# EAGLE design roomba_mod (EAGLE 5.11)
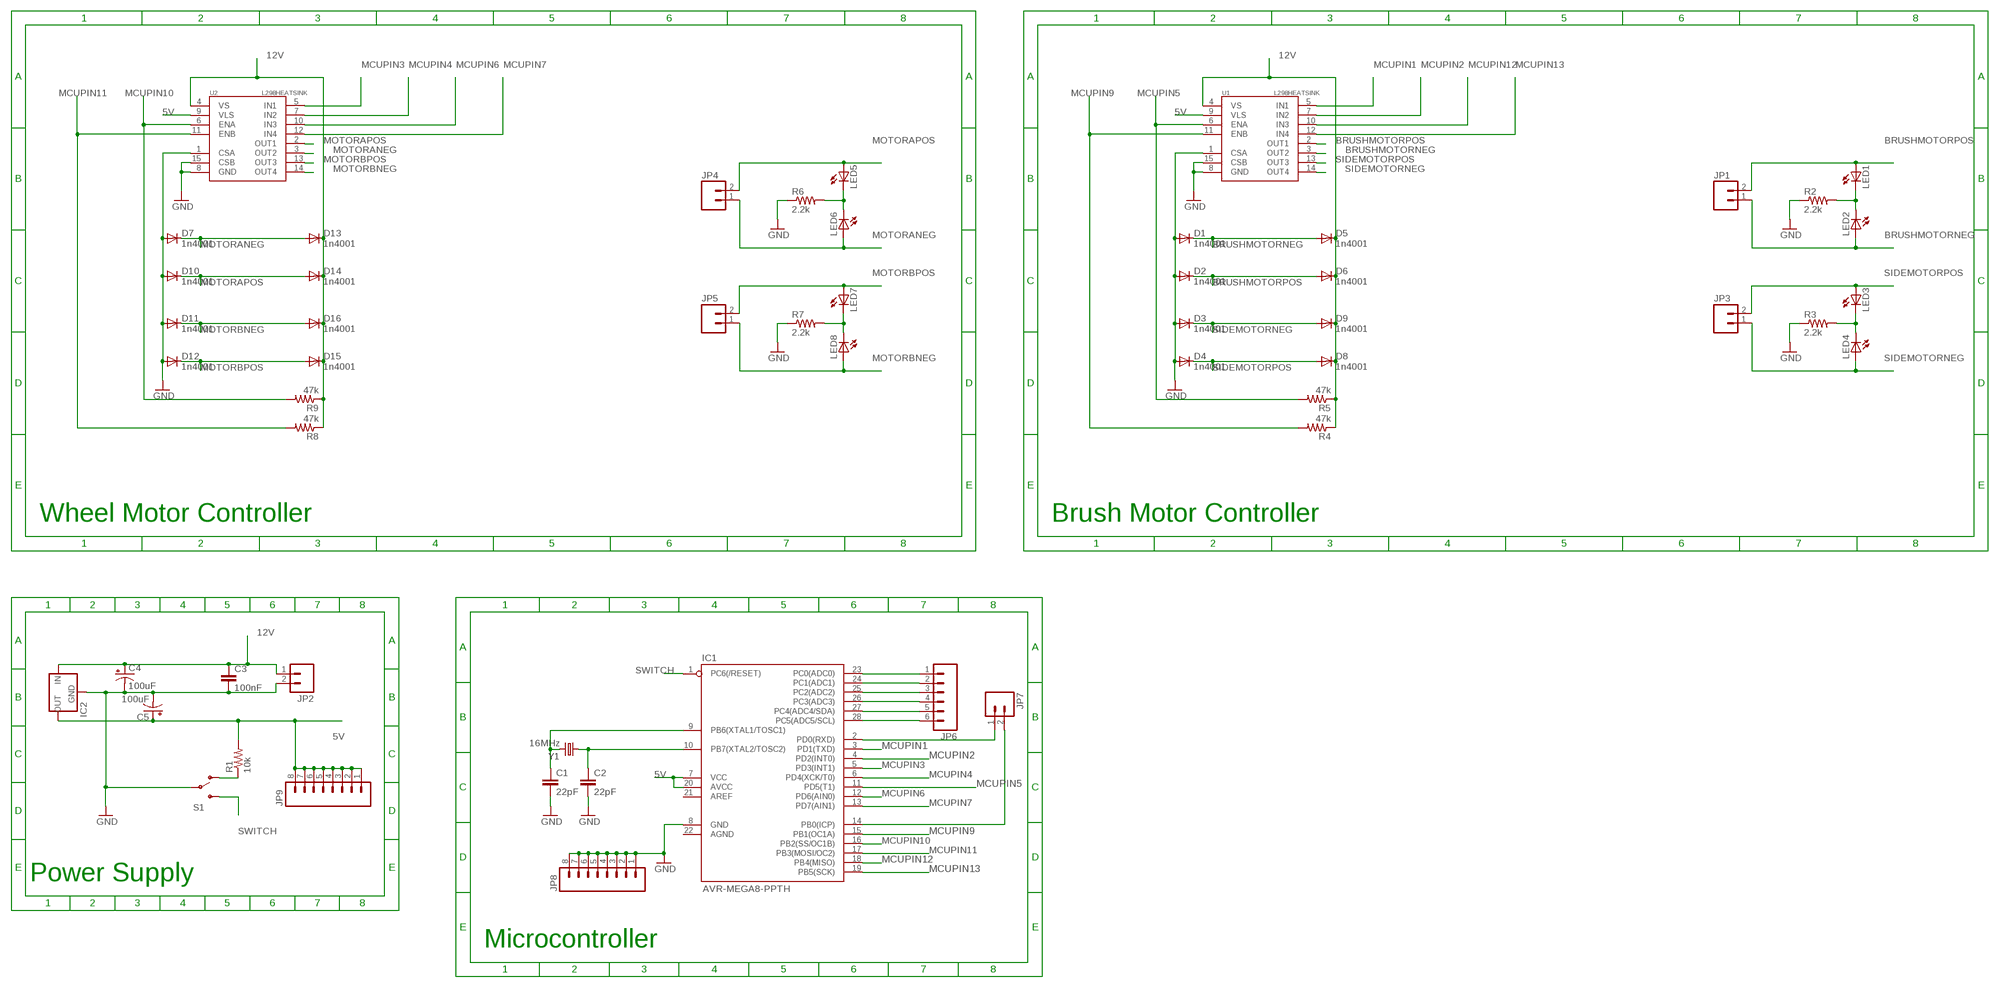
[diagram p0: schematic, sheet 1]

## Parts
C1  22pF  CAPPTH  [CAP-PTH-SMALL]
C2  22pF  CAPPTH  [CAP-PTH-SMALL]
C3  100nF  CAPKIT  [CAP-PTH-SMALL-KIT]
C4  100uF  CAP_POLPTH2  [CPOL-RADIAL-10UF-25V]
C5  100uF  CAP_POLPTH2  [CPOL-RADIAL-10UF-25V]
D1  1n4001  DIODEPTH  [DIODE-1N4001]
D2  1n4001  DIODEPTH  [DIODE-1N4001]
D3  1n4001  DIODEPTH  [DIODE-1N4001]
D4  1n4001  DIODEPTH  [DIODE-1N4001]
D5  1n4001  DIODEPTH  [DIODE-1N4001]
D6  1n4001  DIODEPTH  [DIODE-1N4001]
D7  1n4001  DIODEPTH  [DIODE-1N4001]
D8  1n4001  DIODEPTH  [DIODE-1N4001]
D9  1n4001  DIODEPTH  [DIODE-1N4001]
D10  1n4001  DIODEPTH  [DIODE-1N4001]
D11  1n4001  DIODEPTH  [DIODE-1N4001]
D12  1n4001  DIODEPTH  [DIODE-1N4001]
D13  1n4001  DIODEPTH  [DIODE-1N4001]
D14  1n4001  DIODEPTH  [DIODE-1N4001]
D15  1n4001  DIODEPTH  [DIODE-1N4001]
D16  1n4001  DIODEPTH  [DIODE-1N4001]
IC1  AVR-MEGA8-PPTH  [DIL28-3]
IC2  V_REG_78XXSIDE  [78XXL]
JP1  M025MM  [SCREWTERMINAL-5MM-2]
JP2  M025MM  [SCREWTERMINAL-5MM-2]
JP3  M025MM  [SCREWTERMINAL-5MM-2]
JP4  M025MM  [SCREWTERMINAL-5MM-2]
JP5  M025MM  [SCREWTERMINAL-5MM-2]
JP6  M06LOCK  [1X06_LOCK]
JP7  M02LOCK  [1X02_LOCK]
JP8  M08LOCK  [1X08_LOCK]
JP9  M08LOCK  [1X08_LOCK]
LED1  LED3MM  [LED3MM]
LED2  LED3MM  [LED3MM]
LED3  LED3MM  [LED3MM]
LED4  LED3MM  [LED3MM]
LED5  LED3MM  [LED3MM]
LED6  LED3MM  [LED3MM]
LED7  LED3MM  [LED3MM]
LED8  LED3MM  [LED3MM]
R1  10k  RESISTOR1206  [1206]
R2  2.2k  RESISTOR1206  [1206]
R3  2.2k  RESISTOR1206  [1206]
R4  47k  RESISTOR1206  [1206]
R5  47k  RESISTOR1206  [1206]
R6  2.2k  RESISTOR1206  [1206]
R7  2.2k  RESISTOR1206  [1206]
R8  47k  RESISTOR1206  [1206]
R9  47k  RESISTOR1206  [1206]
S1  SWITCH-SPSTPTH  [SWITCH-SPDT]
U1  L298HEATSINK  [MULTIWATT15_6400BGHEATSINK]
U2  L298HEATSINK  [MULTIWATT15_6400BGHEATSINK]
Y1  16MHz  CRYSTALSMD  [HC49UP]

## Nets
5V [mcuvcc]: C5.1(+) IC1.7(VCC) IC1.20(AVCC) IC2.OUT JP9.1 JP9.2 JP9.3 JP9.4 JP9.5 JP9.6 JP9.7 JP9.8 R1.2 U1.9(VLS) U2.9(VLS)
12V [power]: C3.1 C4.1(+) D5.C D6.C D8.C D9.C D13.C D14.C D15.C D16.C IC2.IN JP2.1 R4.1 R5.1 R8.1 R9.1 U1.4(VS) U2.4(VS)
BRUSHMOTORNEG [power]: D1.C D5.A JP1.1 LED2.A U1.3(OUT2)
BRUSHMOTORPOS [power]: D2.C D6.A JP1.2 LED1.A U1.2(OUT1)
GND [power]: C1.2 C2.2 C3.2 C4.2(-) C5.2(-) D1.A D2.A D3.A D4.A D7.A D10.A D11.A D12.A IC1.8(GND) IC2.GND JP2.2 JP8.1 JP8.2 JP8.3 JP8.4 JP8.5 JP8.6 JP8.7 JP8.8 R2.1 R3.1 R6.1 R7.1 S1.2(P) U1.1(CSA) U1.8(GND) U1.15(CSB) U2.1(CSA) U2.8(GND) U2.15(CSB)
MCUPIN1: IC1.3(PD1(TXD)) U1.5(IN1)
MCUPIN2: IC1.4(PD2(INT0)) U1.7(IN2)
MCUPIN3: IC1.5(PD3(INT1)) U2.5(IN1)
MCUPIN4: IC1.6(PD4(XCK/T0)) U2.7(IN2)
MCUPIN5: IC1.11(PD5(T1)) R5.2 U1.6(ENA)
MCUPIN6: IC1.12(PD6(AIN0)) U2.10(IN3)
MCUPIN7: IC1.13(PD7(AIN1)) U2.12(IN4)
MCUPIN9: IC1.15(PB1(OC1A)) R4.2 U1.11(ENB)
MCUPIN10: IC1.16(PB2(SS/OC1B)) R9.2 U2.6(ENA)
MCUPIN11: IC1.17(PB3(MOSI/OC2)) R8.2 U2.11(ENB)
MCUPIN12: IC1.18(PB4(MISO)) U1.10(IN3)
MCUPIN13: IC1.19(PB5(SCK)) U1.12(IN4)
MOTORANEG [power]: D7.C D13.A JP4.1 LED6.A U2.3(OUT2)
MOTORAPOS [power]: D10.C D14.A JP4.2 LED5.A U2.2(OUT1)
MOTORBNEG [power]: D11.C D16.A JP5.1 LED8.A U2.14(OUT4)
MOTORBPOS [power]: D12.C D15.A JP5.2 LED7.A U2.13(OUT3)
N$1: C1.1 IC1.9(PB6(XTAL1/TOSC1)) Y1.2
N$2: C2.1 IC1.10(PB7(XTAL2/TOSC2)) Y1.1
N$3: LED1.K(C) LED2.K(C) R2.2
N$4: LED5.K(C) LED6.K(C) R6.2
N$5: LED7.K(C) LED8.K(C) R7.2
N$6: R1.1 S1.1(O)
N$7: IC1.23(PC0(ADC0)) JP6.1
N$8: IC1.24(PC1(ADC1)) JP6.2
N$9: IC1.25(PC2(ADC2)) JP6.3
N$10: IC1.26(PC3(ADC3)) JP6.4
N$11: LED3.K(C) LED4.K(C) R3.2
N$12: IC1.27(PC4(ADC4/SDA)) JP6.5
N$13: IC1.28(PC5(ADC5/SCL)) JP6.6
N$14: IC1.2(PD0(RXD)) JP7.1
N$15: IC1.14(PB0(ICP)) JP7.2
SIDEMOTORNEG [power]: D3.C D9.A JP3.1 LED4.A U1.14(OUT4)
SIDEMOTORPOS [power]: D4.C D8.A JP3.2 LED3.A U1.13(OUT3)
SWITCH: IC1.1(PC6(/RESET)) S1.3(S)
Unconnected: IC1.21(AREF) IC1.22(AGND)

## Notes on the sheet
- Wheel Motor Controller | Brush Motor Controller
- Power Supply
- Microcontroller

## Library data of the parts
C1-C3 = SparkFun:CAP: Capacitor Standard 0603 ceramic capacitor, and 0.1" leaded capacitor.
C4 C5 = SparkFun:CAP_POL: Capacitor Polarized These are standard SMD and PTH capacitors. Normally 10uF, 47uF, and 100uF in electrolytic and tantalum varieties. Always verify the external diameter of the through hole cap, it varies with capacity, voltage, and manufacturer. The EIA devices should be standard.
D1-D16 = SparkFun:DIODE: Diode These are standard reverse protection diodes and small signal diodes. SMA package can handle up to about 1A. SOD-323 can handle about 200mA. What the SOD-323 package when ordering, there are some mfgs out there that are 5-pin packages.
IC1 = SparkFun:AVR-MEGA8-P: MICROCONTROLLER 8 Kbytes FLASH 1 kbytes SRAM 512 bytes EEPROM USART 4-channel 10 bit ADC 2-channel 8 bit ADC
IC2 = SparkFun:V_REG_78XX: Voltage Regulator Standard 7805 5V regulator. IGO (Input Ground Output). Spark Fun Electronics SKU : COM-00107
JP1-JP5 JP7 = SparkFun:M02: Header 2 Standard 2-pin 0.1" header. Use with straight break away headers (SKU : PRT-00116), right angle break away headers (PRT-00553), swiss pins (PRT-00743), machine pins (PRT-00117), and female headers (PRT-00115). Molex polarized connector foot print use with SKU : PRT-08233 with associated crimp pins and housings.
JP6 = SparkFun:M06: Header 6 Standard 6-pin 0.1" header. Use with straight break away headers (SKU : PRT-00116), right angle break away headers (PRT-00553), swiss pins (PRT-00743), machine pins (PRT-00117), and female headers (PRT-00115). Molex polarized connector foot print use with SKU : PRT-08094 with associated crimp pins and housings. NOTES ON THE VARIANTS LOCK and LOCK_LONGPADS... This footprint was designed to help hold the alignment of a through-hole component (i.e. 6-pin header) while soldering it into place. You may notice that each hole has been shifted either up or down by 0.005 of an inch from it's more standard position (which is a perfectly straight line). This slight alteration caused the pins (the squares in the middle) to touch the edges of the holes. Because they are alternating, it causes a "brace" to hold the component in place. 0.005 has proven to be the perfect amount of "off-center" position when using our standard breakaway headers. Although looks a little odd when you look at the bare footprint, once you have a header in there, the alteration is very hard to notice. Also, if you push a header all the way into place, it is covered up entirely on the bottom side. This idea of altering the position of holes to aid alignment will be further integrated into the Sparkfun Library for other footprints. It can help hold any component with 3 or more connection pins.
JP8 JP9 = SparkFun:M08: Header 8 Standard 8-pin 0.1" header. Use with straight break away headers (SKU : PRT-00116), right angle break away headers (PRT-00553), swiss pins (PRT-00743), machine pins (PRT-00117), and female headers (PRT-00115).
LED1-LED8 = SparkFun:LED: LEDs Standard schematic elements and footprints for 5mm, 3mm, 1206, and 0603 sized LEDs. 5mm - Spark Fun Electronics SKU : COM-00529 (and others)
R1-R9 = SparkFun:RESISTOR: Resistor Basic schematic elements and footprints for 0603, 1206, and PTH resistors.
S1 = SparkFun:SWITCH-SPST: SPST Switch Simple slide switch. Spark Fun Electronics SKU : COM-00102
U1 U2 = SparkFun:L298: L298 Dual Full Bridge Driver
Y1 = SparkFun:CRYSTAL: Crystals Various standard crystals. Proven footprints. Spark Fun Electronics SKU : COM-00534

## Net classes
1 power: width 0.889 mm, drill 0.508 mm, clearance 0.254 mm
2 mcuvcc: width 0.381 mm, drill 0.508 mm, clearance 0.203 mm

## Board
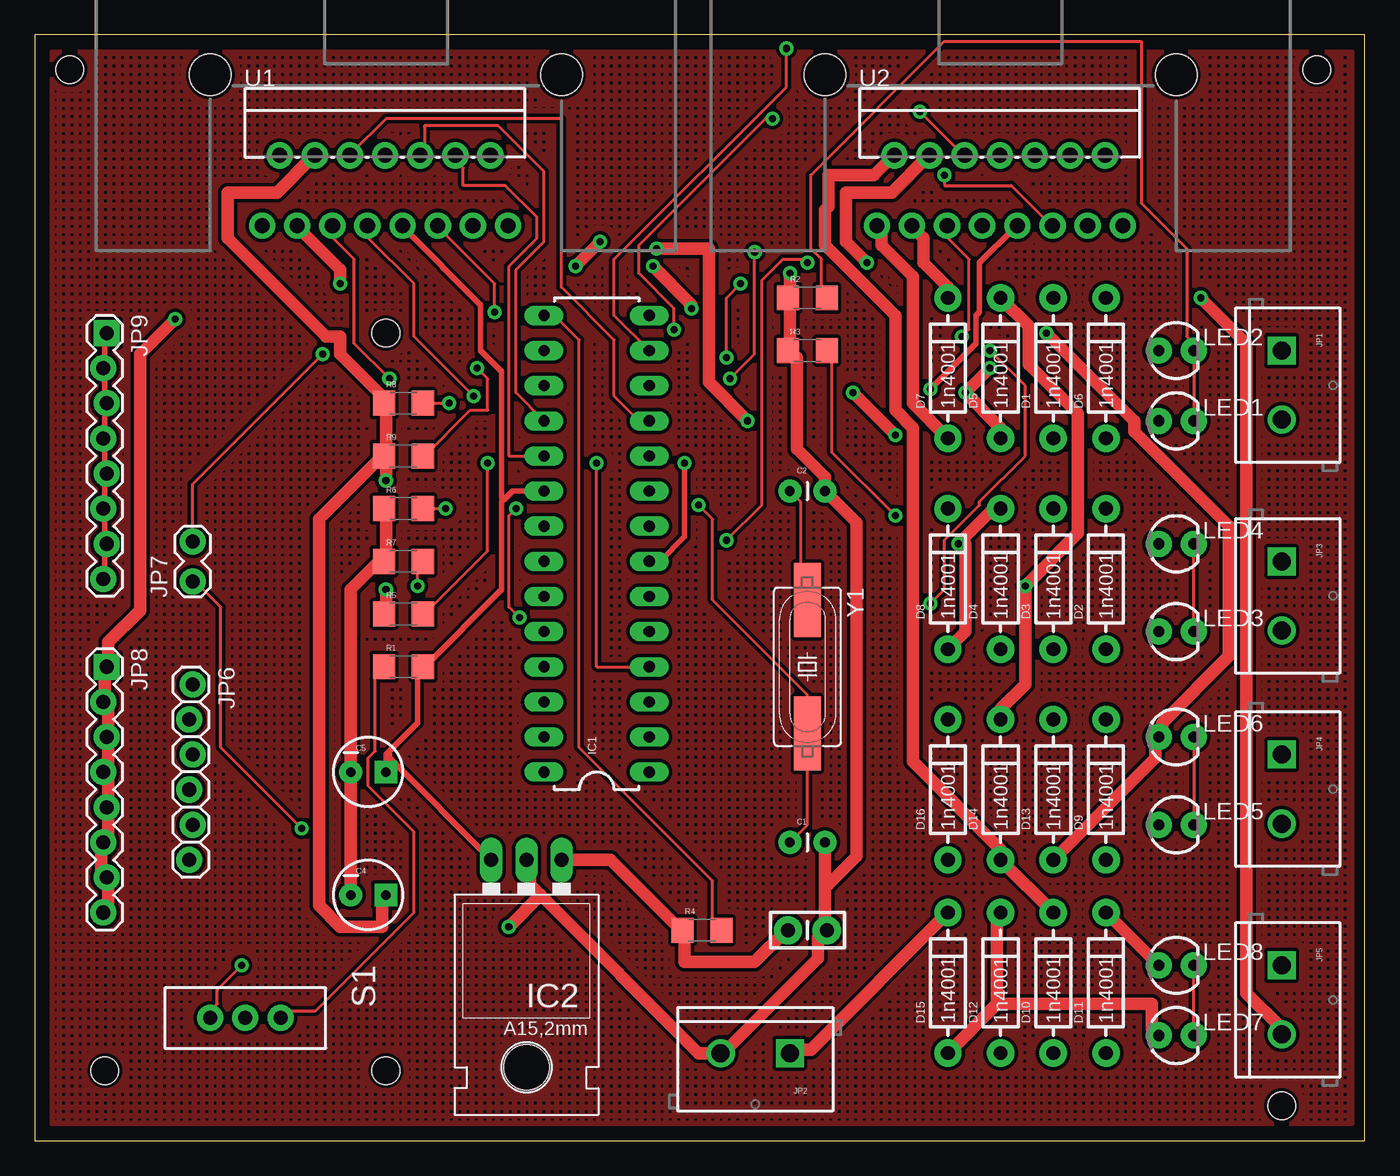
[diagram p1: board, top side]
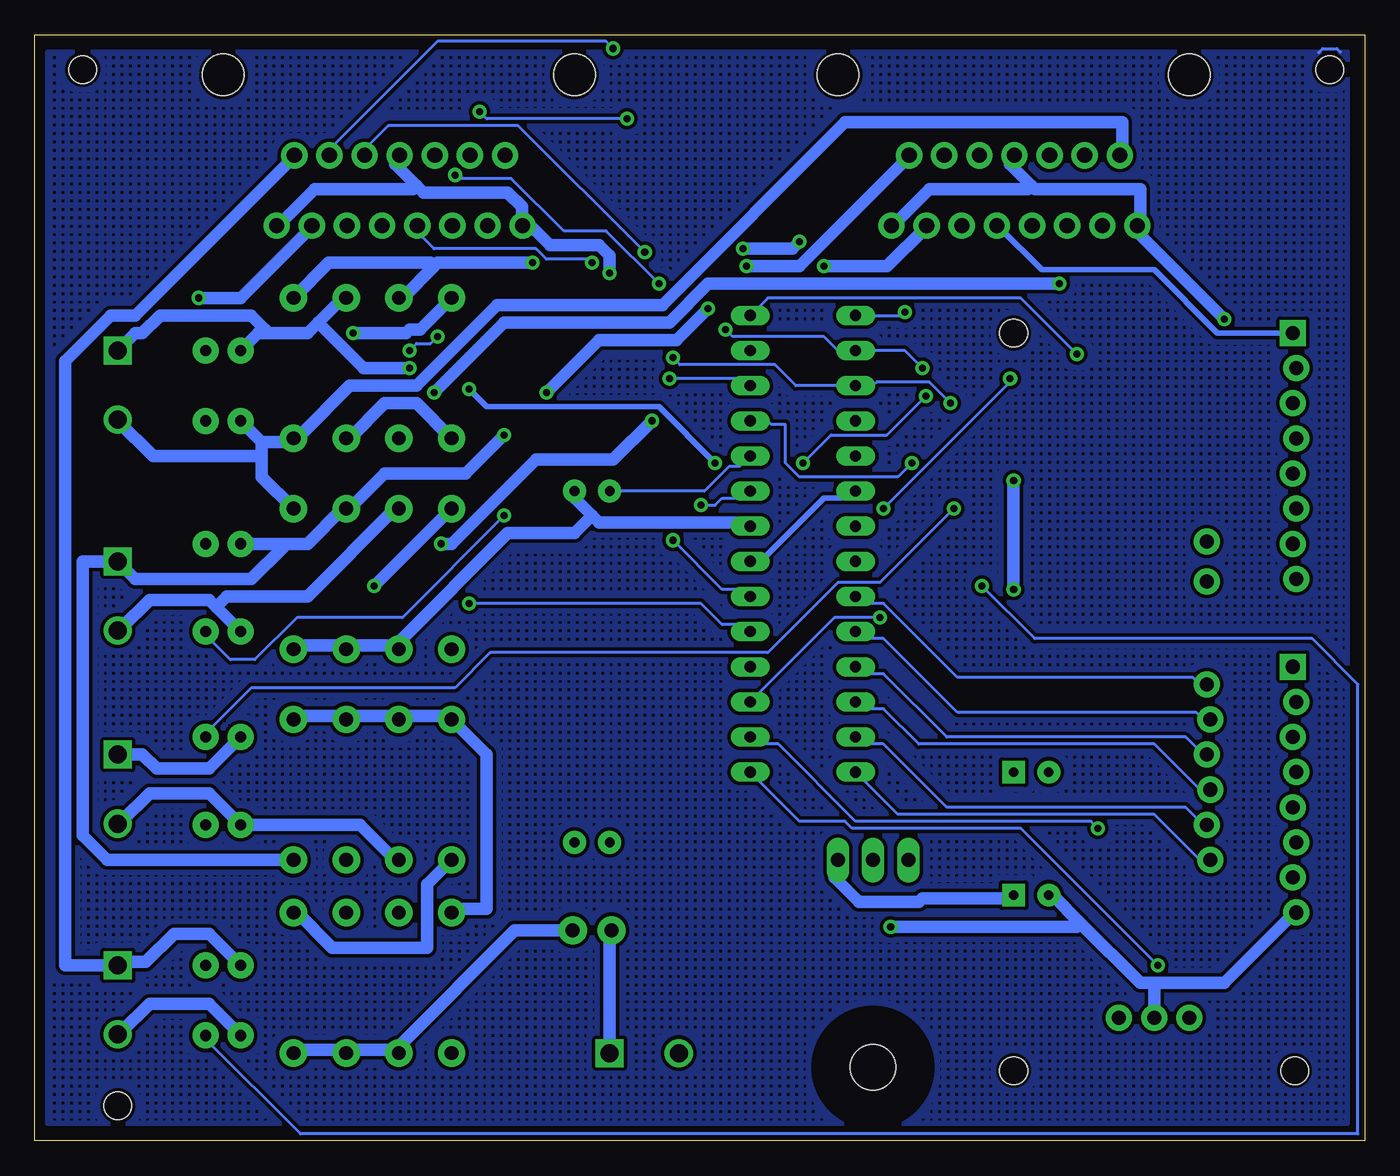
[diagram p2: board, bottom side, seen from below]

Size 96.19 x 80 mm. Coordinates in mm from the lower left corner, seen from the top.
Outline: 0,0 96.19,0 96.19,80 0,80 0,0
Copper layers (1*16): Top 0.035mm / dielectric 1.5mm / Bottom 0.035mm
Design rules "SparkFun": minimum track width 8mil, minimum drill 20mil, track to track 8mil, track to pad 8mil, pad to pad 8mil, via to via 8mil, smd to smd 8mil, copper to edge 10mil, drill to drill 8mil, minimum pad ring 12mil, minimum via ring 10mil, stop-mask expansion 4mil, vias tented up to drill 25mil, thermal gap 10mil
Holes 2 mm at 2.54,77.47 92.71,77.47 90.17,2.54 25.4,5.08 5.08,5.08 25.4,58.42

### Footprints (pad centres in the part's own frame; a part is rotated, then mirrored left to right if it is on the bottom)
CAP-PTH-SMALL = drill 0.7 pad 1.651 round: 1 0,0; 2 2.54,0
CAP-PTH-SMALL-KIT = drill 1.016 pad 2.032 round: 1 -1.397,0; 2 1.397,0
CPOL-RADIAL-10UF-25V = drill 0.7 pad 1.651 square: 1 1.27,0 | drill 0.7 pad 1.651 round: 2 -1.27,0
DIODE-1N4001 = drill 1 pad 1.981 round: A -5.08,0; C 5.08,0
DIL28-3 = drill 0.813 long: 1 -16.51,-3.81; 2 -13.97,-3.81; 3 -11.43,-3.81; 4 -8.89,-3.81; 5 -6.35,-3.81; 6 -3.81,-3.81; 7 -1.27,-3.81; 8 1.27,-3.81; 9 3.81,-3.81; 10 6.35,-3.81; 11 8.89,-3.81; 12 11.43,-3.81; 13 13.97,-3.81; 14 16.51,-3.81; 15 16.51,3.81; 16 13.97,3.81; 17 11.43,3.81; 18 8.89,3.81; 19 6.35,3.81; 20 3.81,3.81; 21 1.27,3.81; 22 -1.27,3.81; 23 -3.81,3.81; 24 -6.35,3.81; 25 -8.89,3.81; 26 -11.43,3.81; 27 -13.97,3.81; 28 -16.51,3.81
78XXL = drill 1.016 long: GND 0,-3.81; IN -2.54,-3.81; OUT 2.54,-3.81 | hole 3.302: 0,11.176
SCREWTERMINAL-5MM-2 = drill 1.3 pad 2.032 square: 1 0,0 | drill 1.3 pad 2.032 round: 2 5,0
1X06_LOCK = drill 1.016 pad 1.88 round: 1 0,0; 2 2.54,-0.254; 3 5.08,0; 4 7.62,-0.254; 5 10.16,0; 6 12.7,-0.254
1X02_LOCK = drill 1.016 pad 1.88 round: 1 -0.178,0; 2 2.718,0
1X08_LOCK = drill 1.016 pad 1.88 square: 1 0,0.127 | drill 1.016 pad 1.88 round: 2 2.54,-0.127; 3 5.08,0.127; 4 7.62,-0.127; 5 10.16,0.127; 6 12.7,-0.127; 7 15.24,0.127; 8 17.78,-0.127
LED3MM = drill 0.813 pad 1.88 round: A -1.27,0; K 1.27,0
1206 = smd 1.6 x 1.8: 1 -1.4,0; 2 1.4,0
SWITCH-SPDT = drill 1.016 pad 1.88 round: 1 0,2.54; 2 0,0; 3 0,-2.54
MULTIWATT15_6400BGHEATSINK = drill 1.1 pad 1.9 round: 1 -8.95,-2.39; 2 -7.68,2.69; 3 -6.41,-2.39; 4 -5.14,2.69; 5 -3.87,-2.39; 6 -2.6,2.69; 7 -1.33,-2.39; 8 -0.06,2.69; 9 1.21,-2.39; 10 2.48,2.69; 11 3.75,-2.39; 12 5.02,2.69; 13 6.29,-2.39; 14 7.56,2.69; 15 8.83,-2.39 | hole 2.997: -12.7,8.509; 12.7,8.509
HC49UP = smd 5.334 x 1.93: 1 -4.826,0; 2 4.826,0

### Placement (x,y rotation side)
C1  54.61,21.59 0 top
C2  54.61,46.99 0 top
C3  55.88,15.24 0 top
C4  24.13,17.78 0 top
C5  24.13,26.67 0 top
D1  73.66,55.88 90 top
D2  77.47,40.64 90 top
D3  73.66,40.64 90 top
D4  69.85,40.64 90 top
D5  69.85,55.88 90 top
D6  77.47,55.88 90 top
D7  66.04,55.88 90 top
D8  66.04,40.64 90 top
D9  77.47,25.4 90 top
D10  73.66,11.43 90 top
D11  77.47,11.43 90 top
D12  69.85,11.43 90 top
D13  73.66,25.4 90 top
D14  69.85,25.4 90 top
D15  66.04,11.43 90 top
D16  66.04,25.4 90 top
IC1  40.64,43.18 90 top
IC2  35.56,16.51 180 top
JP1  90.17,57.15 270 top
JP2  54.61,6.35 180 top
JP3  90.17,41.91 270 top
JP4  90.17,27.94 270 top
JP5  90.17,12.7 270 top
JP6  11.43,33.02 270 top
JP7  11.43,40.64 90 top
JP8  5.08,34.29 270 top
JP9  5.08,58.42 270 top
LED1  82.55,52.07 0 top
LED2  82.55,57.15 0 top
LED3  82.55,36.83 0 top
LED4  82.55,43.18 0 top
LED5  82.55,22.86 0 top
LED6  82.55,29.21 0 top
LED7  82.55,7.62 0 top
LED8  82.55,12.7 0 top
R1  26.67,34.29 0 top
R2  55.88,60.96 0 top
R3  55.88,57.15 0 top
R4  48.26,15.24 0 top
R5  26.67,38.1 0 top
R6  26.67,45.72 0 top
R7  26.67,41.91 0 top
R8  26.67,53.34 0 top
R9  26.67,49.53 0 top
S1  15.24,8.89 270 top
U1  25.4,68.58 0 top
U2  69.85,68.58 0 top
Y1  55.88,34.29 270 top

### Tracks (layer width: path | path; a pad name or v marks a point on that pad's centre or on a via)
5V  (via drill 0.51)
  Top 0.381: 5.08,50.8 5.08,53.34 | 5.08,43.18 5.08,40.64 JP9.8 | 5.08,45.72 5.08,48.26 | 5.08,43.18 5.08,45.72 | 5.08,43.18 JP9.7 | 5.08,45.72 JP9.6 | 5.08,48.26 5.08,50.8 | 5.08,50.8 JP9.4 | 5.08,48.26 JP9.5 | 5.08,55.88 5.08,58.42 JP9.1 | 5.08,53.34 5.08,55.88 | 5.08,53.34 JP9.3 | 5.08,55.88 JP9.2 | 25.53,28.07 25.4,27.94 C5.1 | 25.53,28.07 27.69,30.23 27.69,34.04 27.94,34.29 R1.2 28.19,34.29 33.78,39.88 33.78,46.23 33.91,46.35 | IC2.OUT 25.65,27.69 25.65,27.94 25.53,28.07 | v64.77,54.36 68.07,57.66 68.07,59.69 68.33,59.94 68.33,63.5 70.87,66.04 U2.9 | v46.99,49.02 46.99,43.69 45.21,41.91 IC1.7 | 33.91,46.35 34.54,46.99 IC1.20 | U1.9 26.67,66.04 32.26,60.45 32.26,57.15 33.78,55.63 33.78,46.48 33.91,46.35
  Bottom 0.381: U1.9 26.42,66.04 23.37,62.99 15.24,62.99 10.67,58.42 JP9.1 | IC1.20 37.34,46.48 39.12,46.48 43.69,41.91 IC1.7 | v64.77,54.36 63.5,53.09 51.05,53.09 v46.99,49.02
12V  (via drill 0.51)
  Top 0.889: v60.2,63.5 58.67,65.02 58.67,68.58 61.98,68.58 64.52,71.12 U2.4 | D14.C 69.85,31.24 71.63,33.02 v71.63,40.13 75.44,43.94 75.44,52.58 71.88,56.13 71.88,58.93 D5.C | v25.4,39.88 25.4,38.1 R5.1 | v25.4,47.75 25.4,49.53 R9.1 | R9.1 25.4,49.78 25.4,53.34 R8.1 25.15,53.59 25.15,53.85 22.1,56.9 22.1,58.17 21.08,58.17 13.97,65.28 13.97,68.58 17.53,68.58 20.07,71.12 U1.4 | D15.C 56.13,6.6 54.61,6.6 JP2.1 | IC2.IN 41.66,20.32 46.74,15.24 R4.1 46.99,14.99 46.99,12.95 52.07,12.95 54.36,15.24 C3.1 | C4.1 25.15,17.53 25.15,15.49 22.1,15.49 20.57,17.02 20.57,44.96 24.89,49.28 R9.1
  Bottom 0.889: v60.2,63.5 67.06,63.5 67.31,63.25 | 67.31,63.25 69.6,60.96 D5.C | D6.C 74.93,63.5 67.56,63.5 67.31,63.25 | D9.C 77.22,30.73 73.91,30.73 D13.C 73.41,30.73 70.1,30.73 D14.C 69.34,30.48 69.09,30.73 66.29,30.73 D16.C 63.5,27.94 63.5,16.76 65.28,16.76 65.53,16.51 D15.C | v71.63,40.13 D8.C | v25.4,47.75 v25.4,39.88 | JP2.1 54.61,15.24 C3.1 | C4.1 25.65,17.53 32,17.53 32.26,17.27 36.58,17.27 38.35,19.05 38.35,20.32 IC2.IN
BRUSHMOTORNEG  (via drill 0.51)
  Top 0.889: v22.1,61.98 22.1,62.99 19.05,66.04 U1.3 | D5.A 69.85,51.56 v67.31,54.1 v69.09,55.88
  Bottom 0.889: LED2.A 80.01,58.42 79.5,58.42 | 79.5,58.42 76.45,58.42 75.69,59.18 | 75.69,59.18 73.91,60.96 D1.C | JP1.1 88.9,58.42 88.39,58.42 87.12,59.69 80.52,59.69 79.5,58.67 79.5,58.42 | v22.1,61.98 47.5,61.98 50.29,59.18 62.23,59.18 v67.31,54.1 | v69.09,55.88 72.39,55.88 75.69,59.18
BRUSHMOTORPOS
  Bottom 0.889: 79.76,50.55 LED1.A | 79.76,50.55 78.23,50.55 77.98,50.8 D6.A 77.22,51.05 76.96,51.05 73.41,54.61 68.58,54.61 62.74,60.45 50.8,60.45 37.59,73.66 17.53,73.66 17.53,71.37 U1.2 | D2.C 79.76,48.01 79.76,49.53 | 79.76,50.55 79.76,49.53 | JP1.2 90.17,52.07 87.63,49.53 79.76,49.53
GND  (via drill 0.51)
  Top 0.889: D7.A 63.5,53.34 63.5,62.48 61.21,64.77 61.21,65.53 60.96,65.79 60.96,66.04 U2.1 | v54.61,62.74 54.61,61.21 R2.1 54.61,60.96 54.61,57.15 R3.1 54.86,56.9 55.12,56.64 55.12,50.04 57.15,48.01 C2.2 59.44,44.7 59.44,20.57 57.4,18.54 57.15,18.54 | 57.15,18.54 57.15,15.24 C3.2 56.9,14.99 56.64,14.73 56.64,13.21 50.04,6.6 50.04,6.35 JP2.2 48.01,6.35 36.58,17.78 | 57.15,18.54 C1.2 | IC2.GND 35.81,20.07 35.81,18.54 36.58,17.78 | JP8.8 5.08,16.51 5.33,16.76 5.33,19.05 JP8.7 5.08,19.3 4.83,19.56 4.83,20.83 5.08,21.08 5.08,21.34 JP8.6 5.08,21.59 5.33,21.84 5.33,24.13 JP8.5 5.08,24.38 5.08,24.64 5.33,24.89 5.33,26.42 JP8.4 5.08,26.67 5.33,26.92 5.33,29.21 JP8.3 5.08,29.46 5.08,29.72 5.33,29.97 5.33,31.5 JP8.2 5.08,31.75 5.08,34.29 JP8.1 5.33,34.54 5.33,36.07 7.62,38.35 7.62,56.9 v10.16,59.44 | R6.1 25.4,45.72 25.4,41.91 R7.1 24.89,41.91 22.86,39.88 C5.2 C4.2 | v34.29,15.49 36.58,17.78
  Bottom 0.889: D7.A 68.58,53.34 70.87,53.34 73.41,50.8 D1.A | 68.58,69.09 70.1,70.61 70.1,71.12 69.85,71.12 U2.8 | 68.58,69.09 68.07,68.58 61.98,68.58 60.96,67.56 60.96,66.29 U2.1 60.45,66.29 58.93,64.77 55.37,64.77 54.61,64.01 v54.61,62.74 | U2.15 78.49,66.29 75.95,68.83 68.83,68.83 68.58,69.09 | D2.A 77.22,35.81 73.91,35.81 D3.A 73.15,35.56 72.9,35.81 70.1,35.81 D4.A 69.85,36.07 61.98,43.94 57.15,43.94 55.88,45.21 | IC1.8 44.7,44.7 55.37,44.7 55.88,45.21 | 55.88,45.21 57.15,46.48 C2.2 | D11.A 77.22,6.6 73.91,6.6 D10.A 73.15,6.35 72.9,6.6 70.1,6.6 D12.A 69.85,6.86 61.47,15.24 C3.2 | 24.13,69.09 25.65,70.61 25.65,71.12 25.4,71.12 U1.8 | 24.13,69.09 23.88,68.83 16.26,68.83 16.26,66.29 U1.1 16.51,65.79 v10.16,59.44 | U1.15 34.04,66.29 31.5,68.83 24.38,68.83 24.13,69.09 | 15.24,11.43 S1.2 | 15.24,11.43 16.26,11.43 20.57,15.75 | 20.57,15.75 22.61,17.78 C4.2 | JP8.8 5.08,16.51 10.16,11.43 15.24,11.43 | v34.29,15.49 20.83,15.49 20.57,15.75
MCUPIN1  (via drill 0.51)
  Top 0.203: v35.05,37.85 34.29,38.61 34.29,45.21 v34.8,45.72 | v25.65,55.12 23.11,57.66 23.11,63.75 21.59,65.28 21.59,66.04 U1.5
  Bottom 0.203: IC1.3 38.35,37.85 v35.05,37.85 | v34.8,45.72 25.65,54.86 v25.65,55.12
MCUPIN2  (via drill 0.51)
  Top 0.203: IC1.4 40.64,34.29 v40.64,49.02 | v31.75,53.85 27.43,58.17 27.43,61.98 24.13,65.28 24.13,66.04 U1.7
  Bottom 0.203: v40.64,49.02 38.61,51.05 34.54,51.05 v31.75,53.85
MCUPIN3  (via drill 0.51)
  Top 0.203: v64.77,38.86 65.79,39.88 65.79,43.43 68.33,45.97 68.33,46.23 71.63,49.53 71.63,54.61 v69.09,57.15 | v67.06,58.17 67.56,58.67 67.56,63.75 66.04,65.28 66.04,66.04 U2.5
  Bottom 0.203: IC1.5 44.96,37.34 46.48,37.34 48.01,38.86 v64.77,38.86 | v69.09,57.15 68.58,57.66 67.56,57.66 v67.06,58.17
MCUPIN4  (via drill 0.51)
  Top 0.203: v50.04,43.43 52.58,45.97 52.58,62.23 54.1,63.75 55.88,63.75 v55.88,63.5
  Bottom 0.203: IC1.6 44.96,39.88 46.48,39.88 v50.04,43.43 | v55.88,63.5 56.13,63.75 59.18,63.75 59.94,64.52 67.31,64.52 68.33,65.53 68.33,66.04 U2.7
MCUPIN5  (via drill 0.51)
  Top 0.203: v32.77,49.02 32.77,42.67 28.19,38.1 R5.2 | IC1.11 43.69,52.07 41.91,53.85 41.91,57.91 38.1,61.72 38.1,73.91 25.4,73.91 22.86,71.37 U1.6
  Bottom 0.203: v32.77,49.02 33.78,48.01 40.89,48.01 41.91,49.02 41.91,51.82 42.93,51.82 43.18,52.07 IC1.11
MCUPIN6  (via drill 0.51)
  Top 0.203: v50.29,55.12 52.07,56.9 v52.07,64.26
  Bottom 0.203: IC1.12 44.96,55.12 v50.29,55.12 | v52.07,64.26 61.21,73.41 70.61,73.41 72.14,71.88 72.14,71.37 U2.10
MCUPIN7  (via drill 0.51)
  Top 0.203: IC1.13 41.91,59.69 41.91,63.75 54.36,76.2 v54.36,78.99
  Bottom 0.203: v54.36,78.99 54.86,79.5 67.06,79.5 74.68,71.88 74.68,71.37 U2.12
MCUPIN9  (via drill 0.51)
  Top 0.203: IC1.15 37.59,59.69 39.37,57.91 39.37,28.45 49.02,18.8 49.02,15.75 49.53,15.24 R4.2 | v33.27,59.94 33.27,61.98 29.21,66.04 U1.11
  Bottom 0.203: v33.27,59.94 33.53,59.69 IC1.15
MCUPIN10  (via drill 0.51)
  Top 0.203: v32,55.88 32.77,55.12 32.77,52.83 31.5,52.83 28.19,49.53 R9.2 | v64.01,74.42 67.06,71.37 U2.6 | v53.34,73.91 52.83,73.91 43.69,64.77 43.69,62.74 46.23,60.2 v46.23,58.67
  Bottom 0.203: v32,55.88 33.27,57.15 IC1.16 38.1,57.15 39.12,58.17 45.72,58.17 v46.23,58.67 | v64.01,74.42 63.5,73.91 v53.34,73.91
MCUPIN11  (via drill 0.51)
  Top 0.203: R8.2 v29.97,53.34 | v65.79,69.85 65.79,69.09 70.61,69.09 73.41,66.29 U2.11 | v51.05,61.98 50.04,60.96 v50.04,56.64
  Bottom 0.203: v29.97,53.34 31.5,54.86 35.31,54.86 35.56,54.61 IC1.17 41.15,54.61 42.67,56.13 49.53,56.13 v50.04,56.64 | v65.79,69.85 65.53,69.6 61.72,69.6 57.91,65.79 54.86,65.79 v51.05,61.98
MCUPIN12
  Top 0.203: IC1.18 34.8,54.1 34.8,62.99 36.83,65.02 36.83,70.1 33.53,73.41 28.19,73.41 28.19,71.63 27.94,71.37 U1.10
MCUPIN13
  Top 0.203: IC1.19 34.29,49.53 34.29,63.25 36.32,65.28 36.32,66.8 34.04,69.09 30.99,69.09 30.99,70.36 30.48,70.87 30.48,71.12 U1.12
MOTORANEG  (via drill 0.51)
  Top 0.889: D7.C 66.04,61.72 64.26,63.5 64.26,65.28 63.5,66.04 U2.3 | D13.A 81.03,27.69 81.03,28.96 LED6.A 81.53,29.46 81.53,30.23 86.36,35.05 86.36,44.45 79.5,51.31 79.5,52.07 v73.15,58.42
  Bottom 0.889: LED6.A 83.57,26.92 87.38,26.92 88.39,27.94 JP4.1 | D7.C 68.33,58.67 69.09,58.67 69.34,58.42 v73.15,58.42
MOTORAPOS
  Top 0.889: U2.2 61.98,71.12 60.71,69.85 57.4,69.85 57.4,67.56 57.15,67.31 57.15,64.77 62.23,59.69 62.23,52.83 63.5,51.56 63.5,27.43 69.85,21.08 D14.A D10.C
  Bottom 0.889: JP4.2 90.17,23.11 89.92,23.11 87.88,25.15 83.57,25.15 LED5.A 72.64,22.86 70.1,20.32 D14.A
MOTORBNEG
  Top 0.889: D11.C LED8.A
  Bottom 0.889: D16.A 67.82,18.54 67.82,13.97 74.68,13.97 77.22,16.51 D11.C | U2.14 77.47,71.12 88.9,59.69 90.68,59.69 93.98,56.39 93.98,12.7 JP5.1 89.92,12.95 88.14,12.95 86.11,14.99 83.57,14.99 LED8.A
MOTORBPOS  (via drill 0.51)
  Top 0.889: D15.A 69.6,9.91 | 69.6,9.91 69.6,15.75 69.85,16 D12.C | v84.33,60.96 87.63,57.66 87.63,10.67 90.17,8.13 JP5.2 | LED7.A 80.77,8.13 80.77,9.91 69.6,9.91
  Bottom 0.889: LED7.A 83.57,9.91 87.88,9.91 89.92,7.87 90.17,7.87 JP5.2 | v84.33,60.96 81.28,60.96 76.2,66.04 U2.13
N$1  (via drill 0.51)
  Top 0.203: v48.01,45.97 49.02,44.96 49.02,39.12 55.88,32.26 Y1.2 55.88,22.86 C1.1
  Bottom 0.203: IC1.9 44.96,46.48 46.48,46.48 46.99,45.97 v48.01,45.97
N$2
  Top 0.203: Y1.1 55.37,39.62 55.37,46.23 C2.1
  Bottom 0.203: IC1.10 45.21,48.77 45.97,48.77 47.75,46.99 C2.1
N$3
  Top 0.203: R2.2 57.15,60.96 56.9,61.21 56.9,63.75 56.13,64.52 56.13,69.85 65.79,79.5 80.01,79.5 80.01,67.82 83.31,64.52 83.31,58.17 83.82,57.66 LED2.K LED1.K
N$4  (via drill 0.51)
  Top 0.203: R6.2 v29.72,45.72 | LED6.K LED5.K
  Bottom 0.203: v29.72,45.72 35.05,40.39 38.1,40.39 43.18,35.31 63.25,35.31 65.79,32.77 80.52,32.77 83.82,29.46 LED6.K
N$5  (via drill 0.51)
  Top 0.203: v27.69,40.13 27.69,41.66 27.94,41.91 R7.2 | LED7.K LED8.K
  Bottom 0.203: v27.69,40.13 23.88,36.32 3.81,36.32 0.51,33.02 0.51,0.51 76.96,0.51 83.82,7.37 LED7.K
N$6
  Top 0.203: S1.1 17.78,9.4 20.32,9.4 27.43,16.51 27.43,22.35 24.13,25.65 24.13,27.69 24.64,28.19 24.64,33.78 25.15,34.29 R1.1
N$7
  Bottom 0.203: IC1.23 36.32,38.86 34.8,38.86 29.46,33.53 12.45,33.53 11.94,33.02 JP6.1
N$8
  Bottom 0.203: IC1.24 36.32,36.32 34.8,36.32 29.46,30.99 12.19,30.99 11.68,30.48 JP6.2
N$9
  Bottom 0.203: IC1.25 36.32,33.78 34.8,33.78 30.23,29.21 12.95,29.21 11.68,27.94 JP6.3
N$10
  Bottom 0.203: IC1.26 36.32,31.24 34.8,31.24 32.26,28.7 15.24,28.7 11.94,25.4 JP6.4
N$11  (via drill 0.51)
  Top 0.203: v62.23,45.21 57.66,49.78 57.66,56.9 57.4,57.15 R3.2 | LED3.K LED4.K
  Bottom 0.203: v62.23,45.21 69.6,37.85 77.22,37.85 80.26,34.8 82.04,34.8 83.82,36.58 LED3.K
N$12
  Bottom 0.203: IC1.27 36.32,28.7 34.8,28.7 30.23,24.13 12.95,24.13 11.68,22.86 JP6.5
N$13
  Bottom 0.203: IC1.28 33.78,23.62 15.24,23.62 11.94,20.32 JP6.6
N$14  (via drill 0.51)
  Top 0.203: v19.3,22.61 13.46,28.45 13.46,38.61 11.43,40.64 JP7.1
  Bottom 0.203: IC1.2 43.94,28.7 42.42,28.7 36.83,23.11 19.81,23.11 v19.3,22.61
N$15  (via drill 0.51)
  Top 0.203: v20.83,56.9 11.43,47.5 JP7.2
  Bottom 0.203: IC1.14 43.18,60.96 24.89,60.96 v20.83,56.9
N$16
  Bottom 0.203: 1.78,78.74 2.03,78.99 3.05,78.99 3.3,78.74 3.36,78.7
  pour Bottom (isolate 0.254, hatched): 1.27,78.74 95.25,78.74 95.25,1.27 1.27,1.27
N$17
  pour Top (isolate 0.254, hatched): 1.27,78.74 95.25,78.74 95.25,1.27 1.27,1.27
SIDEMOTORNEG  (via drill 0.51)
  Top 0.889: v44.7,63.25 47.5,60.45 v47.5,60.2 | v62.23,51.05 v59.18,54.1
  Bottom 0.889: D9.A 90.93,20.32 92.71,22.1 92.71,41.91 JP3.1 88.9,40.64 80.52,40.64 78.23,42.93 78.23,43.18 | 78.23,43.18 76.45,43.18 73.91,45.72 D3.C 73.41,45.97 73.15,45.97 70.87,48.26 65.02,48.26 v62.23,51.05 | 78.23,43.18 LED4.A | v44.7,63.25 40.89,63.25 33.02,71.12 U1.14 | v47.5,60.2 49.78,57.91 55.37,57.91 v59.18,54.1
SIDEMOTORPOS  (via drill 0.51)
  Top 0.889: v39.12,63.25 v40.89,65.02 | v44.96,64.52 48.77,64.52 48.77,54.86 v51.56,52.07 | 67.06,43.43 69.34,45.72 D4.C | v66.8,43.18 67.06,43.43 | D8.A 67.31,36.83 67.31,43.18 67.06,43.43
  Bottom 0.889: 83.06,38.61 83.57,39.12 87.88,39.12 89.92,37.08 90.17,37.08 JP3.2 | 83.06,38.61 LED3.A | v39.12,63.25 34.54,63.25 31.75,66.04 U1.13 | v40.89,65.02 41.4,64.52 v44.96,64.52 | v51.56,52.07 54.36,49.28 59.94,49.28 66.04,43.18 v66.8,43.18 | D4.C 70.1,45.72 76.45,39.37 82.3,39.37 83.06,38.61
SWITCH  (via drill 0.51)
  Top 0.203: v14.99,12.7 13.21,10.92 13.21,9.91 12.7,9.4 S1.3
  Bottom 0.203: IC1.1 40.89,23.11 37.59,23.11 37.08,22.61 24.89,22.61 v14.99,12.7